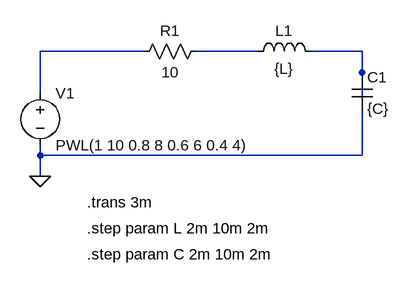
[diagram p0: schematic Draft1.asc]
Draft1.asc, the LTspice schematic file:
Version 4
SHEET 1 880 680
WIRE 304 -240 144 -240
WIRE 480 -240 384 -240
WIRE 640 -240 560 -240
WIRE 640 -208 640 -240
WIRE 144 -176 144 -240
WIRE 640 -160 640 -208
WIRE 144 -80 144 -96
WIRE 640 -80 640 -144
WIRE 640 -80 144 -80
WIRE 144 -48 144 -80
FLAG 144 -48 0
SYMBOL res 400 -256 R90
WINDOW 0 0 56 VBottom 2
WINDOW 3 32 56 VTop 2
SYMATTR InstName R1
SYMATTR Value 10
SYMBOL ind 464 -224 R270
WINDOW 0 32 56 VTop 2
WINDOW 3 5 56 VBottom 2
SYMATTR InstName L1
SYMATTR Value {L}
SYMBOL voltage 144 -192 R0
WINDOW 123 0 0 Left 0
WINDOW 39 0 0 Left 0
SYMATTR InstName V1
SYMATTR Value PWL(1 10 0.8 8 0.6 6 0.4 4)
SYMBOL cap 624 -208 R0
SYMATTR InstName C1
SYMATTR Value {C}
TEXT 216 -8 Left 2 !.trans 3m
TEXT 216 32 Left 2 !.step param L 2m 10m 2m
TEXT 216 72 Left 2 !.step param C 2m 10m 2m

The netlist it stands for:
* Draft1.asc
R1 N002 N001 10
L1 N002 N003 {L}
V1 N001 0 PWL(1 10 0.8 8 0.6 6 0.4 4)
C1 N003 0 {C}
.trans 3m
.step param L 2m 10m 2m
.step param C 2m 10m 2m
.backanno
.end